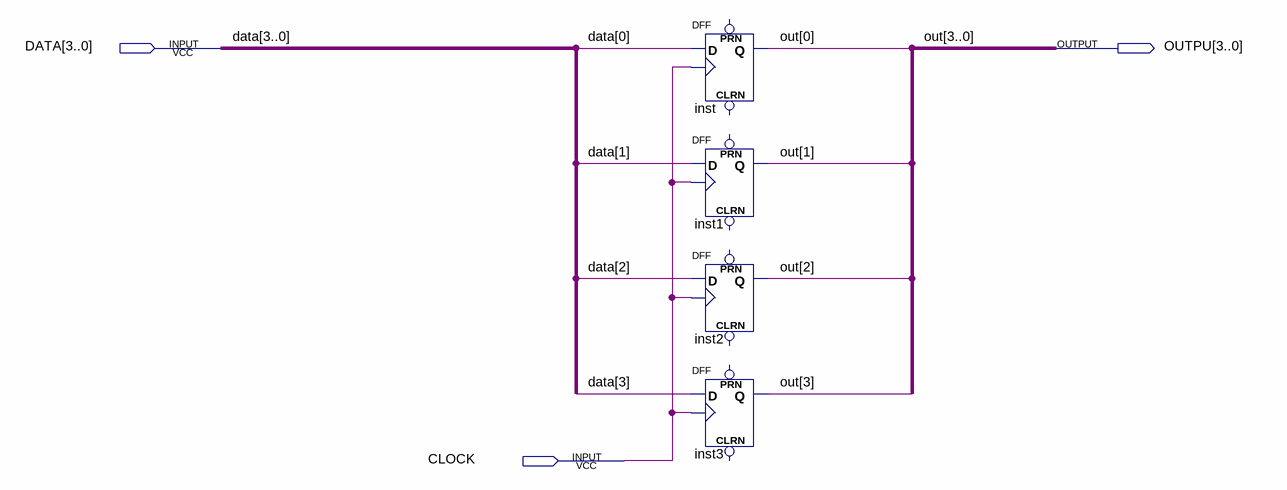
[diagram p0: schematic sheet]
// Quartus schematic Reg4bits.bdf as structural Verilog: 4 symbols, 3 pins
module Reg4bits (
  input  [3:0] DATA,
  input  CLOCK,
  output [3:0] OUTPU
);

  DFF inst (.CLK(CLOCK), .D(DATA[0]), .Q(OUTPU[0]));  // open: CLRN, PRN
  DFF inst1 (.CLK(CLOCK), .D(DATA[1]), .Q(OUTPU[1]));  // open: CLRN, PRN
  DFF inst2 (.CLK(CLOCK), .D(DATA[2]), .Q(OUTPU[2]));  // open: CLRN, PRN
  DFF inst3 (.CLK(CLOCK), .D(DATA[3]), .Q(OUTPU[3]));  // open: CLRN, PRN

  // Other names for the same wires on the sheet: out[3:0] = OUTPU
endmodule
